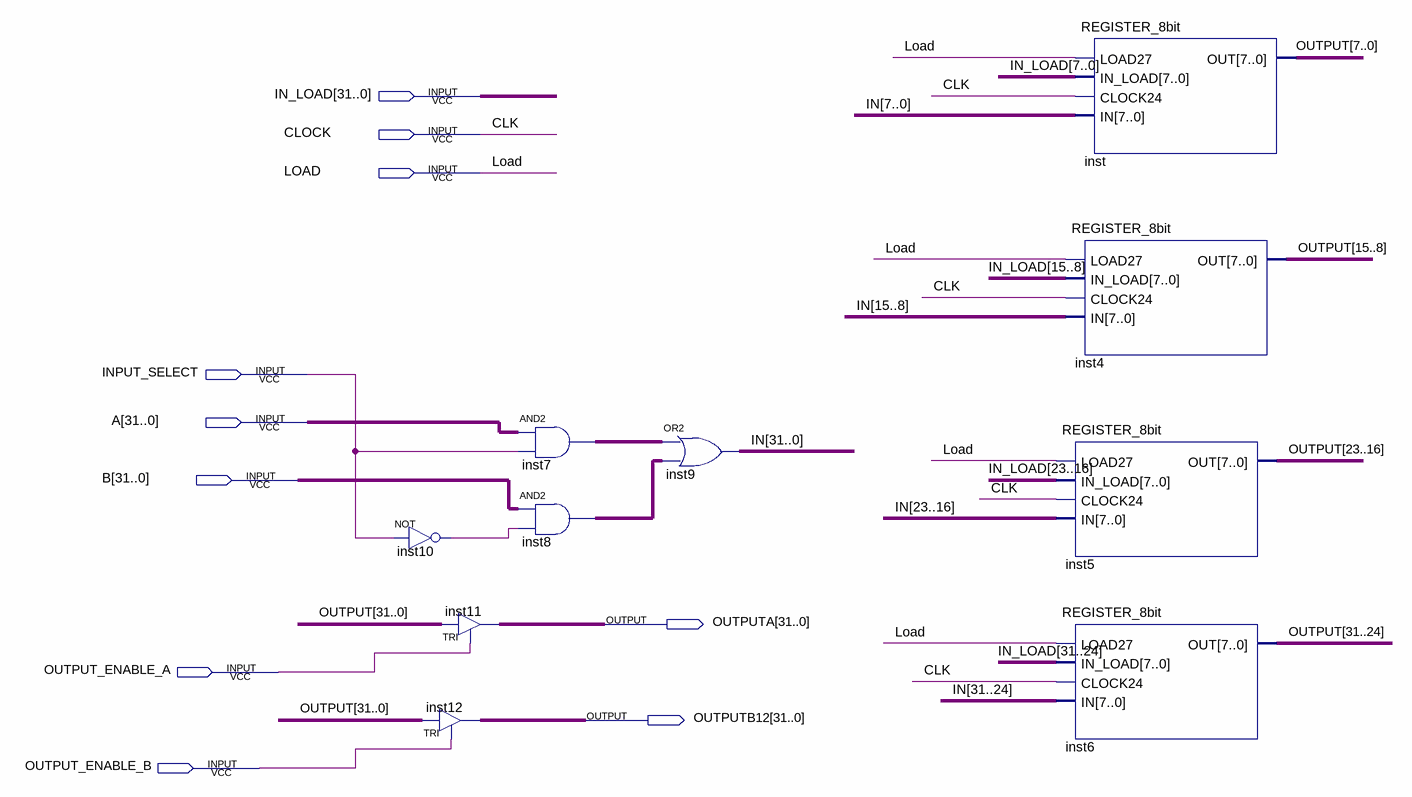
[diagram p0: schematic sheet]
// Quartus schematic Register_32bit.bdf as structural Verilog: 10 symbols, 10 pins
module Register_32bit (
  input  [31:0] IN_LOAD,
  input  CLOCK,
  input  LOAD,
  input  INPUT_SELECT,
  input  [31:0] A,
  input  [31:0] B,
  input  OUTPUT_ENABLE_A,
  input  OUTPUT_ENABLE_B,
  output [31:0] OUTPUTA,
  output [31:0] OUTPUTB12
);

  wire inst10_out;
  wire [31:0] IN, inst7_out, inst8_out, OUTPUT;

  not inst10 (inst10_out, INPUT_SELECT);
  TRI inst11[31:0] (.IN(OUTPUT), .OE(OUTPUT_ENABLE_A), .OUT(OUTPUTA));
  TRI inst12[31:0] (.IN(OUTPUT), .OE(OUTPUT_ENABLE_B), .OUT(OUTPUTB12));
  assign inst7_out = A & {32{INPUT_SELECT}};  // AND2 inst7, 32 bits wide
  assign inst8_out = B & {32{inst10_out}};  // AND2 inst8, 32 bits wide
  assign IN = inst7_out | inst8_out;  // OR2 inst9, 32 bits wide
  REGISTER_8bit inst (.LOAD27(LOAD), .IN_LOAD(IN_LOAD[7:0]), .CLOCK24(CLOCK), .IN(IN[7:0]), .OUT(OUTPUT[7:0]));
  REGISTER_8bit inst4 (.LOAD27(LOAD), .IN_LOAD(IN_LOAD[15:8]), .CLOCK24(CLOCK), .IN(IN[15:8]), .OUT(OUTPUT[15:8]));
  REGISTER_8bit inst5 (.LOAD27(LOAD), .IN_LOAD(IN_LOAD[23:16]), .CLOCK24(CLOCK), .IN(IN[23:16]), .OUT(OUTPUT[23:16]));
  REGISTER_8bit inst6 (.LOAD27(LOAD), .IN_LOAD(IN_LOAD[31:24]), .CLOCK24(CLOCK), .IN(IN[31:24]), .OUT(OUTPUT[31:24]));

  // Other names for the same wires on the sheet: CLK = CLOCK
endmodule
